# EAGLE design mimuz-ch55x (EAGLE 9.6.2)
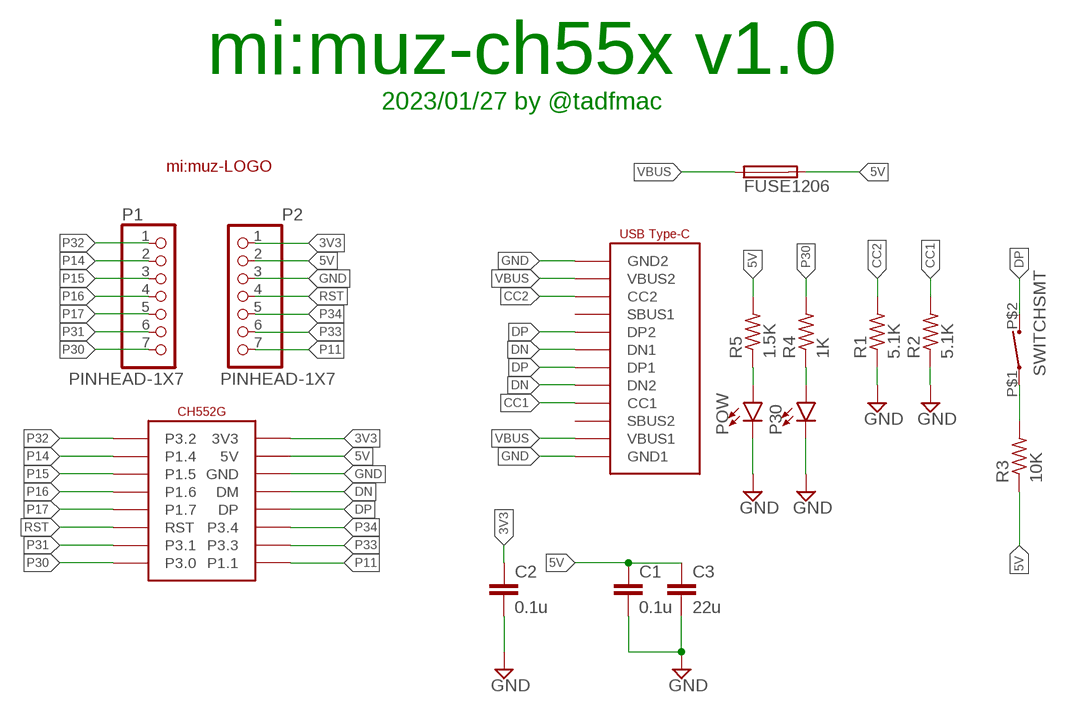
[diagram p0: schematic, sheet 1]

## Parts
*  CH552G  [SOIC16]
C1  0.1u  C-EUC0603  [C0603]
C2  0.1u  C-EUC0603  [C0603]
C3  22u  C-EUC0805  [C0805]
P1  PINHEAD-1X7  [PINHEAD-1X7]
P2  PINHEAD-1X7  [PINHEAD-1X7]
P30  LED  [LED-0603]
POW  LED  [LED-0603]
R1  5.1K  R-US_R0603  [R0603]
R2  5.1K  R-US_R0603  [R0603]
R3  10K  R-US_R0603  [R0603]
R4  1K  R-US_R0603  [R0603]
R5  1.5K  R-US_R0603  [R0603]
U$1  MIMUZ6MM  [MIMUZ-SMALL]
U$2  USB-C  [USB-C]
U$3  FUSE1206  [F1206]
U$4  SWITCHSMT  [SWITCH-SMT-2*4*3]

## Nets
3V3: *.16(3V3) C2.1 P2.1
5V: *.15(5V) C1.1 C3.1 P2.2 R3.1 R5.2 U$3.2
CC1: R2.2 U$2.CC1
CC2: R1.2 U$2.CC2
DN: *.13(DM) U$2.DN1 U$2.DN2
DP: *.12(DP) U$2.DP1 U$2.DP2 U$4.P$2
GND: *.14(GND) C1.2 C2.2 C3.2 P2.3 P30.C POW.C R1.1 R2.1 U$2.GND1 U$2.GND2
N$1: R3.2 U$4.P$1
N$2: POW.A R5.1
N$3: P30.A R4.1
P11: *.9(P1.1) P2.7
P14: *.2(P1.4) P1.2
P15: *.3(P1.5) P1.3
P16: *.4(P1.6) P1.4
P17: *.5(P1.7) P1.5
P30: *.8(P3.0) P1.7 R4.2
P31: *.7(P3.1) P1.6
P32: *.1(P3.2) P1.1
P33: *.10(P3.3) P2.6
P34: *.11(P3.4) P2.5
RST: *.6(RST) P2.4
VBUS: U$2.VBUS1 U$2.VBUS2 U$3.1
Unconnected: U$2.SBUS1 U$2.SBUS2

## Notes on the sheet
- mi:muz-ch55x v1.0
- 2023/01/27 by @tadfmac

## Library data of the parts
* = ch552:CH552G
C1-C3 = 0my:C-EU: CAPACITOR, European symbol
P1 P2 = ch552:PINHEAD-1X7
P30 POW = ch552:LED
R1-R5 = 0my:R-US_: RESISTOR, American symbol
U$1 = logo:MIMUZ
U$2 = ch552:USB-C
U$3 = ch552:FUSE
U$4 = ch552:SWITCH

## Board
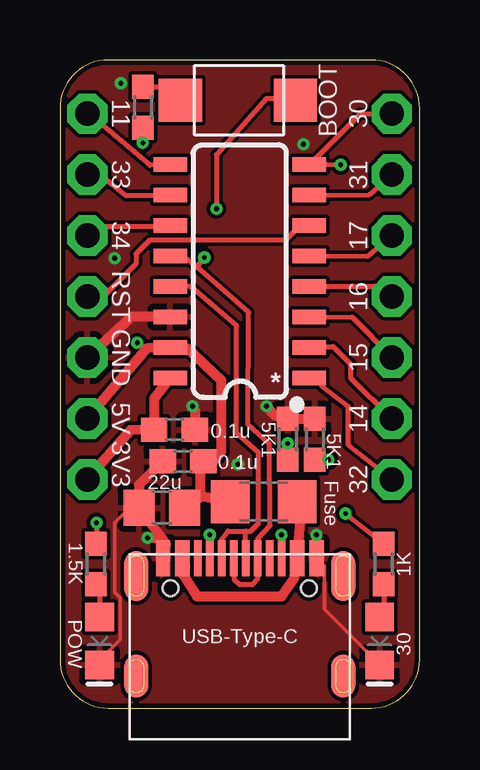
[diagram p1: board, top side]
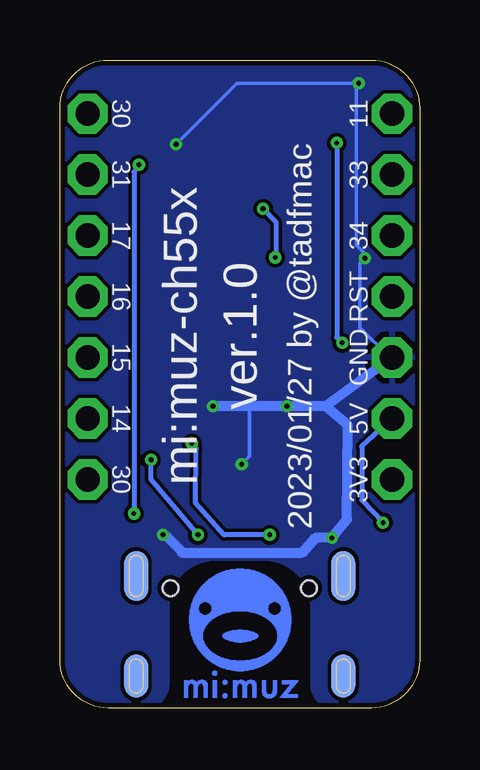
[diagram p2: board, bottom side, seen from below]

Size 15 x 27 mm. Coordinates in mm from the lower left corner, seen from the top.
Outline: 2,0 13,0 arc90 15,2 15,25 arc90 13,27 2,27 arc90 0,25 0,2 arc90 2,0
Copper layers (1*16): Top 0.035mm / dielectric 1.6mm / Bottom 0.035mm
Design rules "Elecrow_2-layer_PCB_eagle_rule *": minimum track width 6mil, minimum drill 12mil, track to track 6mil, track to pad 6mil, pad to pad 6mil, via to via 6mil, smd to smd 0mil, copper to edge 8mil, drill to drill 8mil, minimum pad ring 6mil, minimum via ring 6mil, stop-mask expansion 0mil, vias tented up to drill 100mil, thermal gap 10mil

### Footprints (pad centres in the part's own frame; a part is rotated, then mirrored left to right if it is on the bottom)
SOIC16 = smd 0.6 x 1.4: 1 -4.445,-2.9; 2 -3.175,-2.9; 3 -1.905,-2.9; 4 -0.635,-2.9; 5 0.635,-2.9; 6 1.905,-2.9; 7 3.175,-2.9; 8 4.445,-2.9; 9 4.445,2.9; 10 3.175,2.9; 11 1.905,2.9; 12 0.635,2.9; 13 -0.635,2.9; 14 -1.905,2.9; 15 -3.175,2.9; 16 -4.445,2.9
C0603 = smd 1.1 x 1: 1 -0.85,0; 2 0.85,0
C0805 = smd 1.3 x 1.5: 1 -0.95,0; 2 0.95,0
PINHEAD-1X7 = drill 1.016 pad 1.676 octagon: 1 0,7.62; 2 0,5.08; 3 0,2.54; 4 0,0; 5 0,-2.54; 6 0,-5.08; 7 0,-7.62
LED-0603 = smd 1.2 x 1.2: A -1,0; C 1,0
R0603 = smd 1 x 0.9: 1 -0.85,0; 2 0.85,0
USB-C = smd 0.3 x 1.5: CC1 -1.25,0.25; CC2 1.75,0.25; DN1 0.25,0.25; DN2 -0.75,0.25; DP1 -0.25,0.25; DP2 0.75,0.25; SBUS1 1.25,0.25; SBUS2 -1.75,0.25 | smd 0.6 x 1.5: GND1 -3.2,0.25; GND2 3.2,0.25; VBUS1 -2.4,0.25; VBUS2 2.4,0.25 | smd 1 x 2.1 bottom: H1 -4.32,-0.5; H4 4.32,-0.5 | smd 1 x 2.1: H2 -4.32,-0.5; H3 4.32,-0.5 | smd 1 x 1.8: H5 -4.32,-4.67; H7 4.32,-4.67 | smd 1 x 1.8 bottom: H6 -4.32,-4.67; H8 4.32,-4.67 | hole 0.65: -2.89,-1; 2.89,-1
F1206 = smd 1.6 x 1.8: 1 -1.4,0; 2 1.4,0
SWITCH-SMT-2*4*3 = smd 1.8 x 1.8: P$1 2.4,0; P$2 -2.4,0

### Placement (x,y rotation side)
*  7.5,18.2 90 top
C1  5.13,10.27 180 top
C2  4.78,11.59 0 top
C3  4.25,8.35 180 top
P1  13.84,17.14 180 top
P2  1.14,17.14 180 top
P30  13.34,2.79 270 top
POW  1.65,2.79 270 top
R1  10.63,11.2 270 top
R2  9.5,11.2 270 top
R3  3.47,25.03 90 top
R4  13.5,6 90 top
R5  1.5,6 90 top
U$1  7.5,3 0 bottom
U$2  7.5,6 0 top
U$3  8.5,8.6 180 top
U$4  7.42,25.32 180 top

### Tracks (layer width: path | path; a pad name or v marks a point on that pad's centre or on a via)
3V3
  Top 0.406: *.16 3.94,12.9 C2.1 2.95,11.58 P2.1
5V  (via drill 0.2)
  Top 0.203: R3.1 3.32,23.87 v3.45,23.55 | v3.23,15.21 3.61,14.99 | v1.52,7.72 R5.2
  Top 0.406: 5.36,8.44 C3.1 5.87,8.79 | 5.87,8.79 5.87,10.08 C1.1 6.33,10.16 6.73,10.69 6.73,13.66 5.33,14.96 *.15 3.61,14.99 P2.2 | U$3.2 6.4,8.71 5.71,8.84 5.87,8.79
  Bottom 0.203: v3.45,23.55 3.45,15.44 v3.23,15.21 | P2.2 2.41,10.9 2.41,8.66 1.52,7.75 v1.52,7.72
CC1  (via drill 0.2)
  Top 0.203: U$2.CC1 v6.25,7.21 | v9.5,11.02 R2.2
  Bottom 0.203: v6.25,7.21 8.15,7.21 9.35,8.56 9.32,10.82 v9.5,11.02
CC2  (via drill 0.2)
  Top 0.152: 9.25,7.19 v9.25,7.21
  Top 0.203: U$2.CC2 9.25,7.19 | v11.2,10.34 R1.2
  Bottom 0.203: v9.25,7.21 11.2,9.53 v11.2,10.34
DN
  Top 0.203: U$2.DN2 6.76,7.04 7.01,7.37 7.75,7.37 | 7.75,7.37 7.95,7.37 8.28,7.7 8.28,10.64 7.37,11.46 7.37,15.93 5.46,17.55 *.13 | U$2.DN1 7.75,7.37
DP  (via drill 0.2)
  Top 0.152: 5.18,18.8 *.12
  Top 0.203: U$2.DP1 7.26,5.36 7.49,5.16 8.05,5.16 8.26,5.38 U$2.DP2 8.26,7.06 8.76,7.59 8.74,11 7.85,11.81 7.87,16.48 5.69,18.38 | 5.69,18.38 5.61,18.44 5.36,18.64 5.18,18.8 | v6.02,18.77 5.69,18.38 | v6.53,20.8 6.53,23.06 8.61,25.4 9.74,25.4 U$4.P$2
  Bottom 0.203: v6.53,20.8 5.99,20.24 5.99,18.8 v6.02,18.77
GND  (via drill 0.2)
  Top 0.152: POW.C 1.65,1.98 2.52,2.85 2.52,4.58 2.45,4.65 2.45,4.66 2.29,4.83 2.29,7.72 2.91,8.35 C3.2 | P30.C 11.02,4.11 11.02,5.93 U$2.GND2
  Top 0.406: *.14 2.97,16.31 P2.3 | U$2.GND1 4.42,6.83 4.27,7.07 | 4.27,7.07 C3.2 3.3,9.3 C1.2 | v5.54,12.57 5.64,12.34 C2.2 | v8.61,12.57 8.97,12.19 R2.1 R1.1 | U$2.GND2 10.72,7.24 v10.69,7.21 | v3.66,7.09 4.27,7.07
  Bottom 0.152: v7.42,10.16 7.09,10.49 7.09,12.57 | v10.16,23.5 7.62,26.04 2.64,26.04 | 2.64,26.04 v2.54,26.04 | P2.3 1.25,14.61 2.49,15.85 2.49,18.54 v2.29,18.75 2.29,18.92 2.64,19.28 2.64,26.04
  Bottom 0.406: P2.3 3.94,12.57 | 3.94,12.57 v5.54,12.57 7.09,12.57 v8.61,12.57 | v10.69,7.21 10.62,7.21 9.89,6.49 9.91,6.48 4.88,6.48 4.32,7.11 3.79,7.11 v3.66,7.09 3.02,7.85 3,11.79 3.94,12.57
  pour Top: 0,27 15,27 15,0 0,0
  pour Bottom: 0,27 15,27 15,0 11.5,0 arc-90 10.5,1 10.5,4.2 arc90 8.5,6.2 6.5,6.2 arc90 4.5,4.2 4.5,1 arc-90 3.5,0 0,0
N$1
  Top 0.203: 3.94,25.86 R3.2 4.46,25.88 U$4.P$1
N$2
  Top 0.203: R5.1 1.65,5 POW.A
N$3
  Top 0.203: R4.1 13.5,3.96 P30.A
P11
  Top 0.203: *.9 3.76,22.61 1.14,24.82 P2.7
P14
  Top 0.203: 10.79,15.04 *.2 10.44,15.06 11.4,15.06 12.12,14.35 12.12,13.77 13.82,12.06 P1.2
P15
  Top 0.203: *.3 12.19,16.28 P1.3
P16
  Top 0.203: *.4 13.11,17.58 P1.4
P17
  Top 0.203: *.5 12.83,18.82 P1.5
P30  (via drill 0.2)
  Top 0.203: P1.7 12.52,24.77 *.8 11.12,22.65 11.68,22.63 v11.71,22.63 | v11.91,8.1 R4.2
  Bottom 0.203: v11.71,22.63 11.91,22.33 v11.91,8.1
P31
  Top 0.203: *.7 12.9,21.39 P1.6
P32
  Top 0.203: *.1 10.92,13.74 10.92,13.41 12.01,12.57 12.01,10.97 P1.1
P33
  Top 0.203: P2.6 1.7,22.23 2.74,21.36 *.10
P34
  Top 0.203: P2.5 1.5,20.07 3.94,20.07 *.11
RST
  Top 0.203: *.6 9.86,19.94 9.4,19.48 3.73,19.48 3.17,18.92 3.17,18.52 1.78,17.12 1.17,17.12 P2.4
VBUS
  Top 0.406: 5.23,5.92 U$2.VBUS1 5.13,5.56 5.71,4.65 9.25,4.65 9.75,5.38 9.88,5.89 U$2.VBUS2 10.03,7.77 U$3.1

### Text on the board
tPlace: 11 | BOOT | 30 | 33 | 31 | 34 | 17 | RST | 16 | GND | 15 | * | 5V | 0.1u | 14 | 5K1 | 5K1 | 3V3 | 0.1u | 32 | 22u | Fuse | 1.5K | 1K | POW | 30
bPlace: 11 | 30 | 33 | 31 | 34 | 17 | RST | 16 | 2023/01/27 by @tadfmac | ver.1.0 | mi:muz-ch55x | GND | 15 | 5V | 14 | 3V3 | 30